# EAGLE design untitled (EAGLE 4.16)
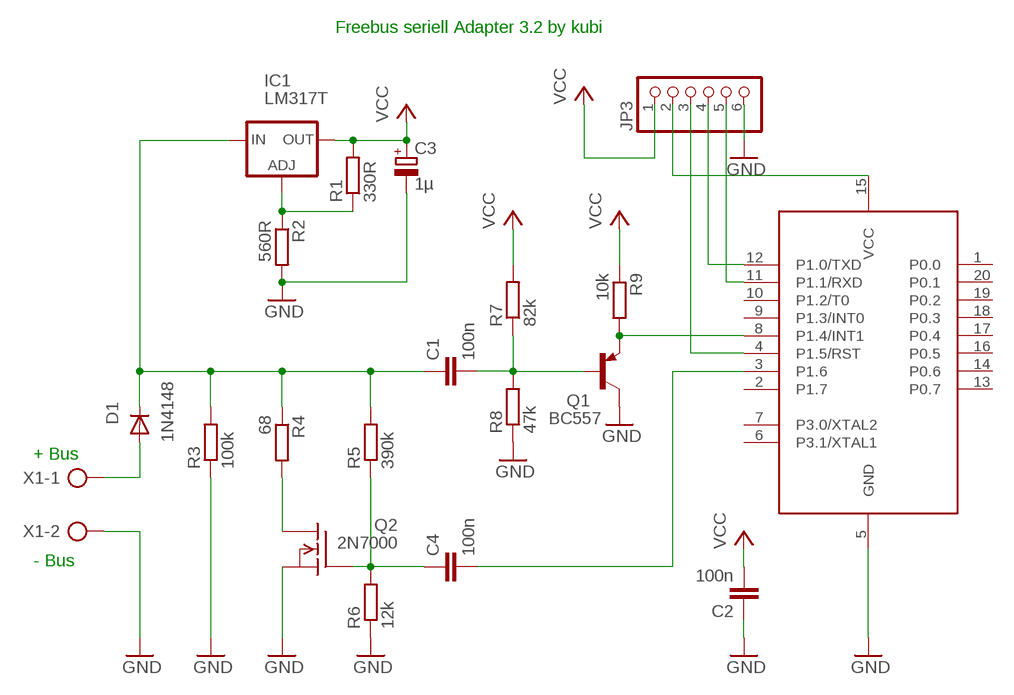
[diagram p0: schematic, sheet 1]

## Parts
C1  100n  C-EU050-024X044  [C050-024X044]
C2  100n  C-EU050-024X044  [C050-024X044]
C3  1µ  CPOL-EUE2.5-5  [E2,5-5]
C4  100n  C-EU050-024X044  [C050-024X044]
D1  1N4148  [DO35-10]
IC1  LM317T  LM317L  [317L]
JP3  PINHD-1X6  [1X06]
Q1  BC557  [TO92]
Q2  2N7000  VN2222KM  [TO237]
R1  330R  R-EU_0207/10  [0207/10]
R2  560R  R-EU_0207/10  [0207/10]
R3  100k  R-EU_0207/10  [0207/10]
R4  68  R-EU_0207/10  [0207/10]
R5  390k  R-EU_0207/10  [0207/10]
R6  12k  R-EU_0207/10  [0207/10]
R7  82k  R-EU_0207/10  [0207/10]
R8  47k  R-EU_0207/10  [0207/10]
R9  10k  R-EU_0207/10  [0207/10]
U1  89LPC922  [DIL20]
X1  AK500/2  [AK500/2]

## Nets
GND: C2.1 C3.- JP3.6 Q1.3(C) Q2.3(S) R2.2 R3.1 R6.1 R8.1 U1.5(GND) X1.2
N$1: Q1.1(E) R9.2 U1.8(P1.4/INT1)
N$2: C1.2 Q1.2(B) R7.1 R8.2
N$4: D1.A X1.1
N$5: C4.2 U1.3(P1.6)
N$6: Q2.1(D) R4.2
N$7: IC1.1(ADJ) R1.1 R2.1
N$9: C1.1 D1.C IC1.3(IN) R3.2 R4.1 R5.2
N$29: JP3.4 U1.12(P1.0/TXD)
N$30: JP3.5 U1.11(P1.1/RXD)
N$31: JP3.3 U1.4(P1.5/RST)
N$32: JP3.2 U1.15(VCC)
N$34: C4.1 Q2.2(G) R5.1 R6.2
VCC: C2.2 C3.+ IC1.2(OUT) JP3.1 R1.2 R7.2 R9.1
Unconnected: U1.1(P0.0) U1.2(P1.7) U1.6(P3.1/XTAL1) U1.7(P3.0/XTAL2) U1.9(P1.3/INT0) U1.10(P1.2/T0) U1.13(P0.7) U1.14(P0.6) U1.16(P0.5) U1.17(P0.4) U1.18(P0.3) U1.19(P0.2) U1.20(P0.1)

## Notes on the sheet
- Freebus seriell Adapter 3.2 by kubi
- + Bus
- - Bus

## Library data of the parts
C1 C2 C4 = rcl:C-EU: CAPACITOR, European symbol
C3 = rcl:CPOL-EU: POLARIZED CAPACITOR, European symbol
D1 = diode:1N4148: DIODE high speed (Philips)
IC1 = v-reg:LM317L: VOLTAGE REGULATOR
JP3 = pinhead:PINHD-1X6: PIN HEADER
Q1 = transistor-pnp:BC557: PNP Transistor
Q2 = transistor-fet:VN2222KM: N-Channel Enhancement MOSFET (VMOS); 60V; 0,5A; 7,5Ohm
R1-R9 = rcl:R-EU_: RESISTOR, European symbol
U1 = micro-philips:89LPC922
X1 = con-ptr500:AK500/2: CONNECTOR

## Board
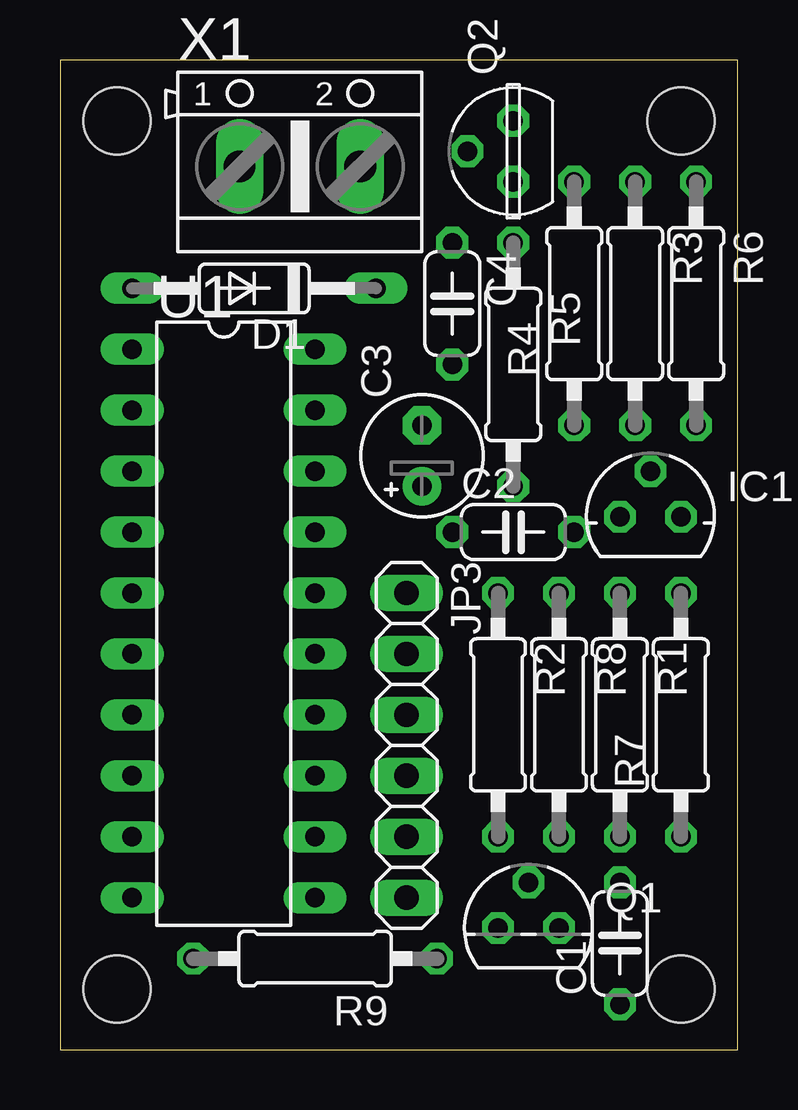
[diagram p1: board, top side]
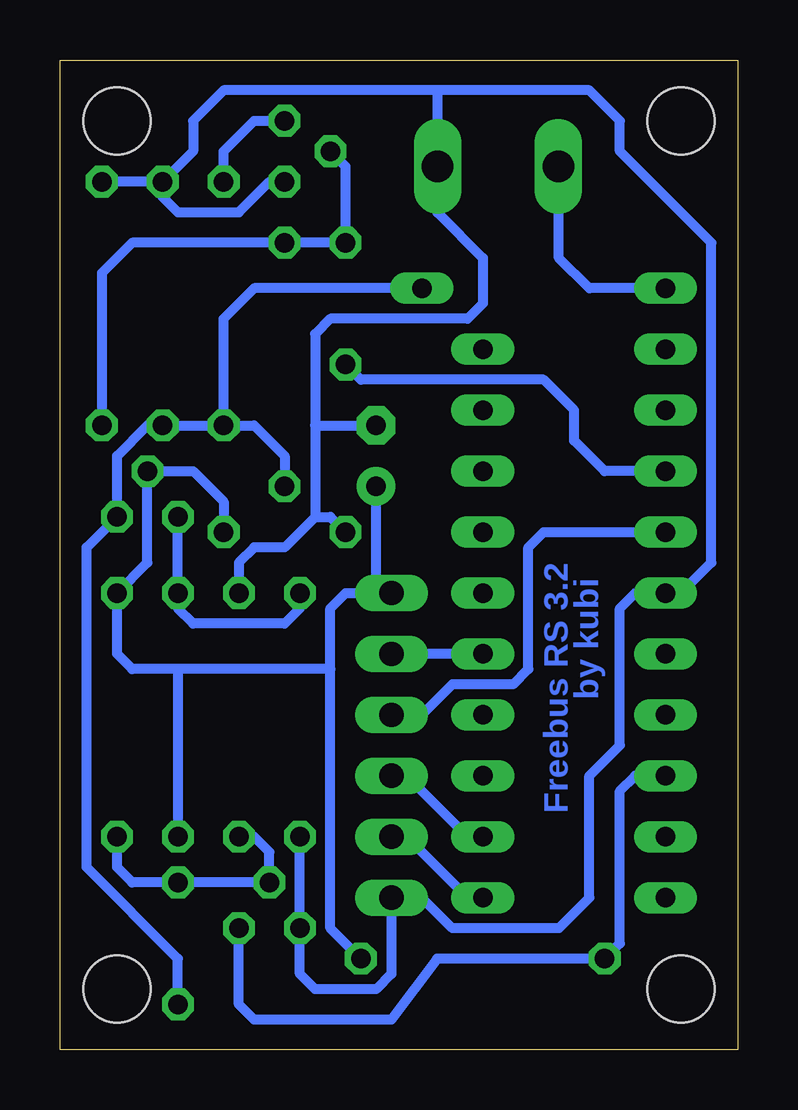
[diagram p2: board, bottom side, seen from below]

Size 28.24 x 41.27 mm. Coordinates in mm from the lower left corner, seen from the top.
Outline: 0,0 28.24,0 28.24,41.27 0,41.27 0,0
Copper layers (1*16): Top 0.035mm / dielectric 1.5mm / Bottom 0.035mm
Design rules "default": minimum track width 10mil, minimum drill 24mil, track to track 16mil, track to pad 12mil, pad to pad 16mil, via to via 16mil, smd to smd 8mil, copper to edge 20mil, drill to drill 8mil, minimum pad ring 10mil, minimum via ring 8mil, stop-mask expansion 4mil, vias tented up to drill 0mil, thermal gap 10mil
Holes 2.8 mm at 2.38,38.73 25.87,38.73 25.87,2.54 2.38,2.54

### Footprints (pad centres in the part's own frame; a part is rotated, then mirrored left to right if it is on the bottom)
C050-024X044 = drill 0.813 octagon: 1 -2.54,0; 2 2.54,0
E2,5-5 = drill 0.813 pad 1.6 round: + -1.27,0 | drill 0.813 pad 1.6 octagon: - 1.27,0
DO35-10 = drill 0.813 long: A 5.08,0; C -5.08,0
317L = drill 0.813 octagon: 1 -1.27,0; 2 0,1.905; 3 1.27,0
1X06 = drill 1.016 long: 1 -6.35,0; 2 -3.81,0; 3 -1.27,0; 4 1.27,0; 5 3.81,0; 6 6.35,0
TO92 = drill 0.813 octagon: 1 1.27,0; 2 0,1.905; 3 -1.27,0
TO237 = drill 0.813 octagon: 1 1.27,0; 2 0,1.905; 3 -1.27,0
0207/10 = drill 0.813 octagon: 1 -5.08,0; 2 5.08,0
DIL20 = drill 0.813 long: 1 -11.43,-3.81; 2 -8.89,-3.81; 3 -6.35,-3.81; 4 -3.81,-3.81; 5 -1.27,-3.81; 6 1.27,-3.81; 7 3.81,-3.81; 8 6.35,-3.81; 9 8.89,-3.81; 10 11.43,-3.81; 11 11.43,3.81; 12 8.89,3.81; 13 6.35,3.81; 14 3.81,3.81; 15 1.27,3.81; 16 -1.27,3.81; 17 -3.81,3.81; 18 -6.35,3.81; 19 -8.89,3.81; 20 -11.43,3.81
AK500/2 = drill 1.321 long: 1 -2.515,0; 2 2.515,0

### Placement (x,y rotation side)
C1  23.33,4.44 90 top
C2  18.88,21.58 0 top
C3  15.08,24.76 90 top
C4  16.34,31.11 270 top
D1  8.09,31.74 180 top
IC1  24.6,22.22 0 top
JP3  14.44,12.7 270 top
Q1  19.52,5.08 0 top
Q2  18.88,37.46 90 top
R1  23.33,13.97 270 top
R2  18.25,13.97 270 top
R3  23.96,31.11 270 top
R4  21.42,31.11 90 top
R5  18.88,28.57 270 top
R6  26.5,31.11 270 top
R7  25.87,13.97 90 top
R8  20.79,13.97 270 top
R9  10.63,3.8 180 top
U1  6.82,17.77 270 top
X1  10,36.83 0 top

### Tracks (layer width: path | path; a pad name or v marks a point on that pad's centre or on a via)
GND
  Bottom 0.406: 12.54,40 6.18,40 4.92,38.73 4.92,37.46 1.1,33.65 1.1,20.31 2.38,19.04 U1.5 4.28,19.04 4.92,18.41 4.92,12.7 6.18,11.43 6.18,6.34 7.46,5.08 11.9,5.08 13.17,6.34 JP3.6 14.44,3.17 15.08,2.54 17.61,2.54 18.25,3.17 Q1.3 R2.2 | 12.54,40 12.54,38.73 12.51,36.8 | R3.1 R6.1 | 12.51,36.8 X1.2 | 12.51,36.8 12.51,34.9 10.63,33.02 10.63,31.11 11.27,30.47 16.98,30.47 17.61,29.84 17.61,26.03 | 17.61,26.03 C3.- | Q2.3 19.52,36.19 20.79,34.92 23.33,34.92 23.96,35.55 R3.1 | R3.1 22.7,37.46 22.7,38.73 21.42,40 12.54,40 | 17.61,26.03 17.61,22.22 | 17.61,22.22 18.88,20.95 20.15,20.95 20.79,20.31 R8.1 | 17.61,22.22 16.98,22.22 C2.1
N$1
  Bottom 0.406: U1.8 4.28,11.43 4.92,10.79 4.92,4.44 R9.2 12.54,3.8 14.44,1.27 20.15,1.27 20.79,1.9 Q1.1
N$2
  Bottom 0.406: R8.2 20.15,8.89 19.52,8.25 Q1.2 C1.2 25.23,6.98 25.87,7.62 R7.1
N$4
  Bottom 0.406: D1.A 6.18,31.74 7.46,33.02 7.46,36.83 X1.1
N$5
  Bottom 0.406: C4.2 15.71,27.93 8.09,27.93 6.82,26.66 6.82,25.39 5.55,24.12 U1.3
N$6
  Bottom 0.406: Q2.1 20.15,38.73 21.42,37.46 R4.2
N$7
  Bottom 0.406: IC1.1 R1.1 23.33,18.41 22.7,17.77 18.88,17.77 18.25,18.41 R2.1
N$9
  Bottom 0.406: D1.C 20.15,31.74 21.42,30.47 R4.1 | C1.1 23.33,3.8 27.14,7.62 27.14,20.95 IC1.3 25.87,24.76 24.6,26.03 R3.2 R4.1 | R4.1 20.15,26.03 18.88,24.76 R5.2
N$29
  Bottom 0.406: U1.12 11.27,8.89 13.81,11.43 JP3.4
N$30
  Bottom 0.406: U1.11 11.27,6.34 13.81,8.89 JP3.5
N$31
  Bottom 0.406: JP3.3 13.17,13.97 11.9,15.24 9.36,15.24 8.73,15.87 8.73,20.95 8.09,21.58 U1.4
N$32
  Bottom 0.406: U1.15 JP3.2
N$34
  Bottom 0.406: R6.2 26.5,32.38 25.23,33.65 R5.1 C4.1 16.34,36.83 Q2.2
VCC
  Bottom 0.406: 15.08,19.04 JP3.1 | 15.08,19.04 C3.+ | 16.98,15.87 23.33,15.87 | 23.33,15.87 25.23,15.87 25.87,16.5 R7.2 24.6,20.31 IC1.2 22.7,24.12 21.42,22.86 C2.2 | 15.08,19.04 16.34,19.04 16.98,18.41 16.98,15.87 | 16.98,15.87 16.98,5.08 R9.1 | 23.33,15.87 R1.2

### Text on the board
Bottom: Freebus RS 3.2 | by kubi